# Altium schematic sheet nrf52833-core.SchDoc
size A; SheetNumber: 2; SheetTotal: 2
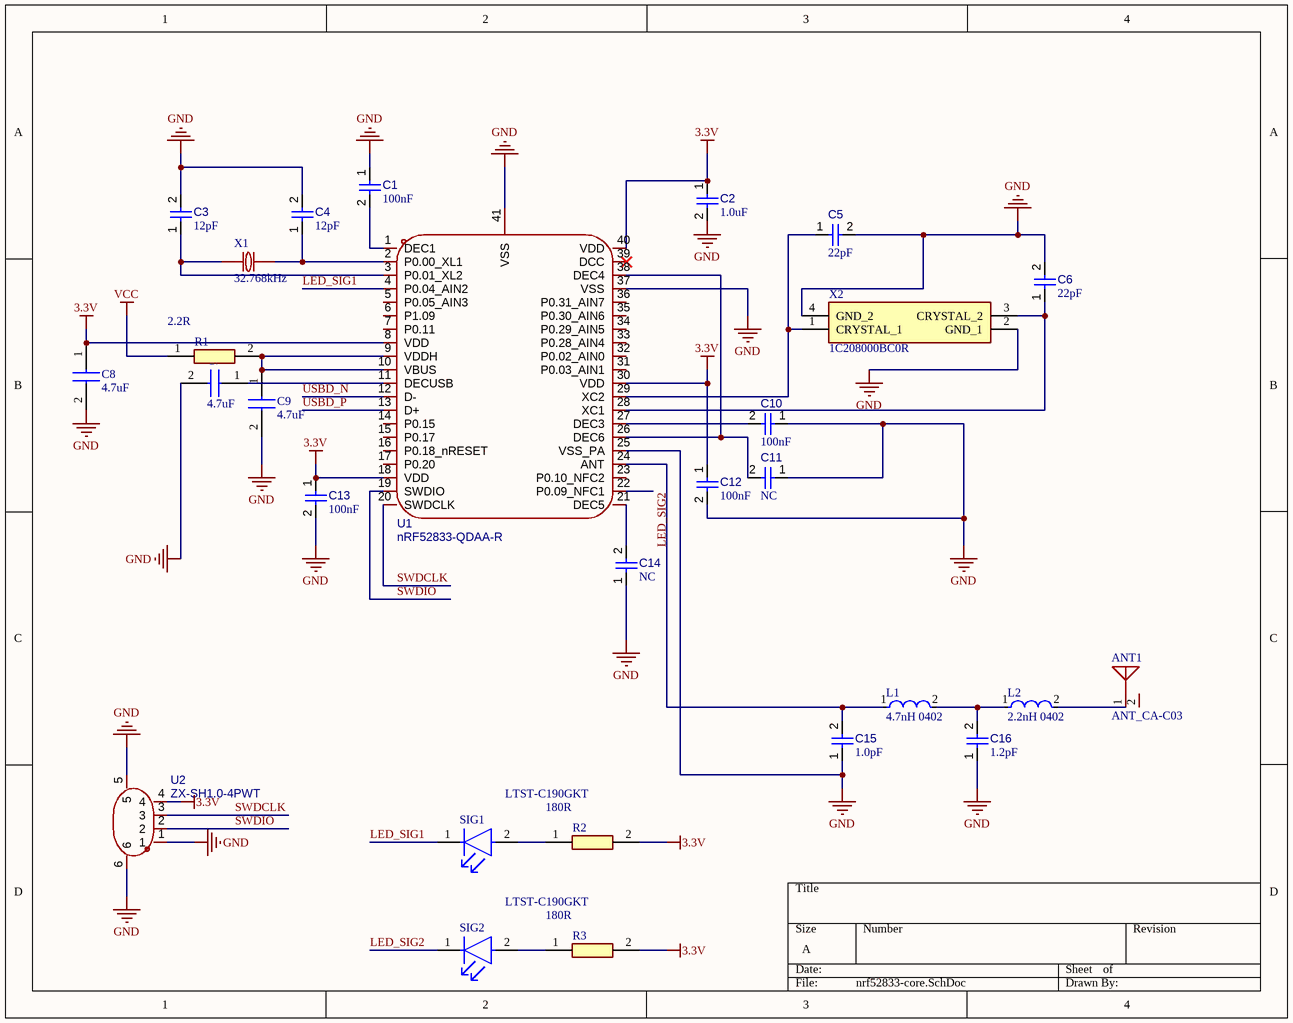
[diagram p0: nrf52833-core.SchDoc]

## Parts
ANT1  ANT_CA-C03  [ANT-SMD_L5.5-W2.0]
C1  value 100nF  [CAPC1005X56X25ML10T15]  (hidden comment: Capacitor 0.1 uF +/- 5% 16 V 0402)
C2  value 1.0uF  [CAPC1005X56X25ML10T15]  (hidden comment: Capacitor 0.1 uF +/- 5% 16 V 0402)
C3  value 12pF  [CAPC0402(1005)33_L]  (hidden comment: Capacitor 12pF +/-10% 50V 0402)
C4  value 12pF  [CAPC0402(1005)33_L]  (hidden comment: Capacitor 12pF +/-10% 50V 0402)
C5  value 22pF  [CAPC0402(1005)33_L]  (hidden comment: Capacitor 12pF +/-10% 50V 0402)
C6  value 22pF  [CAPC0402(1005)33_L]  (hidden comment: Capacitor 12pF +/-10% 50V 0402)
C7  4.7uF  [CAPC1608X87N]
C8  4.7uF  [CAPC1608X87N]
C9  4.7uF  [CAPC1608X87N]
C10  value 100nF  [CAPC1005X56X25ML10T15]  (hidden comment: Capacitor 0.1 uF +/- 5% 16 V 0402)
C11  value NC  [CAPC1005X56X25ML10T15]  (hidden comment: Capacitor 0.1 uF +/- 5% 16 V 0402)
C12  value 100nF  [CAPC1005X56X25ML10T15]  (hidden comment: Capacitor 0.1 uF +/- 5% 16 V 0402)
C13  value 100nF  [CAPC1005X56X25ML10T15]  (hidden comment: Capacitor 0.1 uF +/- 5% 16 V 0402)
C14  value NC  [CAPC1005X56X25ML10T15]  (hidden comment: Capacitor 0.1 uF +/- 5% 16 V 0402)
C15  value 1.0pF  [CAPC0402(1005)33_L]  (hidden comment: Capacitor 12pF +/-10% 50V 0402)
C16  value 1.2pF  [CAPC0402(1005)33_L]  (hidden comment: Capacitor 12pF +/-10% 50V 0402)
L1  4.7nH 0402  [FP-LQW15AN_00-W0_6-0_1-MFG]
L2  2.2nH 0402  [FP-LQW15AN_00-W0_6-0_1-MFG]
R1  2.2R  [RESC1608X55N]
R2  180R  [RESC1608X55N]
R3  180R  [RESC1608X55N]
SIG1  LTST-C190GKT  [FP-LTST-C190GKT-MFG]
SIG2  LTST-C190GKT  [FP-LTST-C190GKT-MFG]
U1  nRF52833-QDAA-R  [QFN-40_L5.0-W5.0-P0.40-TL-EP3.6]
U2  ZX-SH1.0-4PWT  [CONN-SMD_4P-P1.00_MEGASTAR_ZX-SH1.0-4PWT]
X1  32.768kHz  [FC-135R_L3.2-W1.5]
X2  1C208000BC0R  [1C208000BC0R]

## Nets
3.3V: C2.1 C8.1 C12.1 C13.1 R2.2 R3.2 U1.8(VDD) U1.18(VDD) U1.30(VDD) U1.40(VDD) U2.4
GND: C1.1 C2.2 C3.2 C4.2 C5.2 C6.2 C7.2 C8.2 C9.2 C10.1 C11.1 C12.2 C13.2 C14.1 C15.1 C16.1 U1.25(VSS_PA) U1.37(VSS) U1.41(VSS) U2.1 U2.5 U2.6 X2.2(GND_1) X2.4(GND_2)
VCC: R1.1
LED_SIG1: SIG1.1(C) U1.4(P0.04_AIN2)
LED_SIG2: SIG2.1(C) U1.22(P0.09_NFC1)
SWDCLK: U1.20(SWDCLK) U2.3
SWDIO: U1.19(SWDIO) U2.2
USBD_N: U1.12(D-)
USBD_P: U1.13(D+)
NetANT1_1: ANT1.1 L2.2
NetC1_2: C1.2 U1.1(DEC1)
NetC3_1: C3.1 U1.3(P0.01_XL2) X1.1
NetC4_1: C4.1 U1.2(P0.00_XL1) X1.2
NetC5_1: C5.1 U1.29(XC2) X2.1(CRYSTAL_1)
NetC6_1: C6.1 U1.28(XC1) X2.3(CRYSTAL_2)
NetC7_1: C7.1 U1.11(DECUSB)
NetC9_1: C9.1 R1.2 U1.9(VDDH) U1.10(VBUS)
NetC10_2: C10.2 U1.27(DEC3)
NetC11_2: C11.2 U1.26(DEC6) U1.38(DEC4)
NetC14_2: C14.2 U1.21(DEC5)
NetC15_2: C15.2 L1.1 U1.24(ANT)
NetC16_2: C16.2 L1.2 L2.1
NetR2_1: R2.1 SIG1.2(A)
NetR3_1: R3.1 SIG2.2(A)

Not connected (* = marked no-connect by the designer): ANT1 2(NC); U1 5(P0.05_AIN3) 6(P1.09) 7(P0.11) 14(P0.15) 15(P0.17) 16(P0.18_nRESET) 17(P0.20) 23(P0.10_NFC2) 31(P0.03_AIN1) 32(P0.02_AIN0) 33(P0.28_AIN4) 34(P0.29_AIN5) 35(P0.30_AIN6) 36(P0.31_AIN7) 39(DCC)*

## Library data of the parts
ANT1 = ANT_CA-C03: Add into BOM: yes; Symbol: ANT_CA-C03; Device: ANT_CA-C03; LCSC Part Name: ANT_CA-C03; Supplier Part: C9900003739; Manufacturer Part: ANT_CA-C03; Supplier Footprint: ANT-SMD_L5.5-W2.0-P5.0; JLCPCB Part Class: Extended Part; Supplier: LCSC; Convert to PCB: yes
C1 C2 C10-C14 = CMP-001-00001-4: Chip Capacitor, 0.1 uF, +/- 5%, 16 V, 0402 (1005 Metric); Voltage Rating: 16V; Capacitor Type: Ceramic; Pins: 2; Min Operating Temperature: -55°C; Mounting Technology: SM; Max Operating Temperature: 125°C; RoHS Compliant: True; Case/Package: 0402; Tolerance: 5%
C3-C6 C15 C16 = CMP-001-00072-2: Chip Capacitor, 12pF +/-10%, 50V, 0402, Thickness 0.33 mm; Tolerance: 20%; Mounting Technology: SMT; Voltage Rating: 50V; Case/Package: 0603; Pins: 2; Min Operating Temperature: -55°C; Max Operating Temperature: 85°C
C7-C9 = C0603C100D5GACTU: Capacitor; Manufacturer_Name: KEMET; Datasheet Link: https://content.kemet.com/datasheets/KEM_C1003_C0G_SMD.pdf; Height: 0.87mm; Manufacturer_Part_Number: C0603C100D5GACTU; Arrow Part Number: C0603C100D5GACTU; Arrow Price/Stock: https://www.arrow.com/en/products/c0603c100d5gactu/kemet-corporation
L1 L2 = CMP-06042-010257-1: Wire Wound RF Inductor 5.8nH ±0.1nH 700mA 0.09Ω 0402 (1005); Core Material: Air; DC Resistance (DCR): 120mR; Shielding: Unshielded; Test Frequency: 100MHz; Current: 135mA; Q Factor: 25; Self Resonant Frequency: 8GHz; Tolerance: 2%; Max Operating Temperature: 125°C; Width: 0.02inch; Termination: SMD/SMT; Military Standard: Not; Mount: Surface Mount; Packaging: Tape and Reel; Package Quantity: 10000; Current Rating: 700mA; Height: 0.5mm; Case Code (Metric): 1005; Case/Package: 0402; Length: 1mm; Depth: 0.7mm; Max DC Current: 700mA; Min Operating Temperature: -55°C; Case Code (Imperial): 0402; Weight: 2.8E-05oz; Inductance: 5.8nH; REACH SVHC: No SVHC; Radiation Hardening: No; DC Current: 700mA
R1-R3 = CPF0603B107KE: Resistor; Manufacturer_Name: TE Connectivity; Datasheet Link: http://www.farnell.com/datasheets/1786775.pdf; Height: 0.55mm; Manufacturer_Part_Number: CPF0603B107KE; Mouser Part Number: N/A; Mouser Price/Stock: https://www.mouser.co.uk/ProductDetail/TE-Connectivity-Neohm/CPF0603B107KE?qs=chTDxNqvsyktnr3nIHFpYA%3D%3D
SIG1 SIG2 = CMP-22017-000005-2: LED GREEN CLEAR CHIP SMD; Dominant Wavelength: 569nm; Reverse Voltage: 5V; Lens Color: Colorless; Viewing Angle: 130°; Voltage: 2V; Forward Current: 30mA; Power Dissipation: 100mW; Luminous Intensity: 6mcd; Number of LEDs: 1; Forward Voltage: 2.1V; Wavelength: 565nm; Test Current: 10mA; Min Operating Temperature: -55°C; Lens Style: Clear; Mount: Surface Mount; Width: 0.8mm; Packaging: Tape and Reel; Lens Transparency: Clear; Case Code (Metric): 1608; Depth: 0.8mm; Case Code (Imperial): 0603; Case/Package: 0603; Number of Pins: 2; Max Operating Temperature: 85°C; Lead Free: Lead Free; Number of Elements: 1; Length: 1.6mm; Height: 0.8mm; Package Quantity: 1; Power Rating: 100mW; Radiation Hardening: No; Illumination Color: Green; Color: Green
U1 = nRF52833-QDAA-R: Manufacturer: NORDIC; AddInBom: yes; ModelId: e105800079d645bcb749152fa1b71613聨0819f05c4eef4c71ace90d822a990e87; ModelTransform: 197.6374,197.6374,0,0,0,0,0,0,0; Symbol: NRF52833-QDAA-R; Device: nRF52833-QDAA-R; LCSC Part Name: nRF52833-QDAA-R; SupplierPart: C2895249; ManufacturerPart: nRF52833-QDAA-R; Supplier Footprint: QFN-40-EP(5x5); JLCPCB Part Class: Extended Part; Datasheet: https://item.szlcsc.com/datasheet/nRF52833-QDAA-R/3134439.html; Supplier: LCSC; ConvertToPcb: yes; FootprintName: QFN-40_L5.0-W5.0-P0.40-TL-EP3.6; ModelName: QFN-40_L5.0-W5.0-P0.40-TL-EP3.6
U2 = ZX-SH1.0-4PWT: 插针结构:1x4P;间距:1mm;安装方式:卧贴;参考系列:SH;总PIN数:4P;排数:1;每排PIN数:4;行距:-;额定电流:1A;触头材质:黄铜;触头镀层:锡;工作温度:-40℃~+85℃;; Manufacturer: Megastar(兆星); AddInBom: yes; ModelId: 12775bf286e24184ade05a2f5a42ab9d聨0819f05c4eef4c71ace90d822a990e87; ModelTransform: 250.393,198.8185,0,0,0,0,0.2,-7.877,0; Pins Structure: 1x4P; Pitch: 1mm; Reference Series: SH; Number of PINs Per Row: 4; Current Rating: 1A; Voltage Rating: 50V; Plastic Material: LCP; Supplementary Features: 辅助焊脚; Z-Height of the Board: 3.15mm; X-Length of Bottom Edge on Board (Spacing Line): 6.35mm; Y-Width of Bottom Edge on Board: 4.3mm; Symbol: ZX-SH1.0-4PWT; Device: ZX-SH1.0-4PWT; LCSC Part Name: 1x4P 间距:1mm 卧贴 系列:SH; SupplierPart: C7430446; ManufacturerPart: ZX-SH1.0-4PWT; Supplier Footprint: SMD,P=1mm,卧贴; JLCPCB Part Class: Extended Part; Datasheet: https://item.szlcsc.com/datasheet/ZX-SH1.0-4PWT/8430315.html; Supplier: LCSC; ConvertToPcb: yes; FootprintName: CONN-SMD_4P-P1.00_MEGASTAR_ZX-SH1.0-4PWT; ModelName: CONN-SMD_4P-P1.00_MEGASTAR_ZX-SH1.0-4PWT; Mounting Type: 卧贴; Number of Pins: 4P; Number of Rows: 1; Row Spacing: -; Contact Material: 黄铜; Contact Plating: 锡; Operating Temperature: -40℃~+85℃; Flame Retardant Rating: -; Color: 米色
X1 = Q13FC13500004_C32346: Manufacturer: EPSON(爱普生); Symbol: Q13FC1350000400; Add into BOM: yes; Crystal Type: 贴片晶振; Normal temperature Frequency Tolerance: ±20ppm; Load Capacitor: 12.5pF; Equivalent Series Resistance (ESR): 70kΩ; Device: Q13FC13500004_C32346; LCSC Part Name: 32.768kHz ±20ppm 12.5pF; Supplier Part: C32346; Manufacturer Part: Q13FC13500004; Supplier Footprint: SMD3215-2P; JLCPCB Part Class: Basic Part; Datasheet: https://atta.szlcsc.com/upload/public/pdf/source/20240418/0E0FF5F0356BA3753F616001439D1416.pdf; Supplier: LCSC; Convert to PCB: yes; Value: 32.768kHz; Operating Temperature: -40℃~+85℃
X2 = 1C208000BC0R: Crystal or Oscillator; Manufacturer_Name: KDS Daishinku; Datasheet Link: https://datasheet.lcsc.com/szlcsc/1811271030_KDS-Daishinku-KDS-DSX321G-8MHz_C57131.pdf; Height: 0.85mm; Manufacturer_Part_Number: 1C208000BC0R